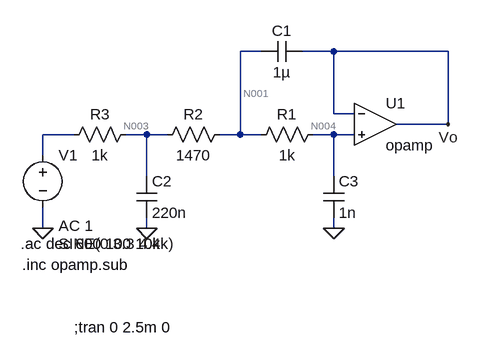
[diagram p0: schematic Chebyshev.asc]
Chebyshev.asc, the LTspice schematic file:
Version 4
SHEET 1 1096 680
WIRE 32 64 0 64
WIRE 144 64 96 64
WIRE 320 64 144 64
WIRE 144 160 144 64
WIRE 176 160 144 160
WIRE 320 176 320 64
WIRE 320 176 240 176
WIRE -256 192 -304 192
WIRE -144 192 -176 192
WIRE -112 192 -144 192
WIRE 0 192 0 64
WIRE 0 192 -32 192
WIRE 32 192 0 192
WIRE 144 192 112 192
WIRE 176 192 144 192
WIRE -304 224 -304 192
WIRE -144 256 -144 192
WIRE 144 256 144 192
WIRE -304 336 -304 304
WIRE -144 336 -144 320
WIRE 144 336 144 320
FLAG -144 336 0
FLAG 144 336 0
FLAG 320 176 Vo
FLAG -304 336 0
SYMBOL OpAmps\\opamp 208 112 R0
SYMATTR InstName U1
SYMBOL res 128 176 R90
WINDOW 0 0 56 VBottom 2
WINDOW 3 32 56 VTop 2
SYMATTR InstName R1
SYMATTR Value 1k
SYMBOL res -16 176 R90
WINDOW 0 0 56 VBottom 2
WINDOW 3 32 56 VTop 2
SYMATTR InstName R2
SYMATTR Value 1470
SYMBOL res -160 176 R90
WINDOW 0 0 56 VBottom 2
WINDOW 3 32 56 VTop 2
SYMATTR InstName R3
SYMATTR Value 1k
SYMBOL cap -160 256 R0
SYMATTR InstName C2
SYMATTR Value 220n
SYMBOL cap 128 256 R0
SYMATTR InstName C3
SYMATTR Value 1n
SYMBOL cap 96 48 R90
WINDOW 0 0 32 VBottom 2
WINDOW 3 32 32 VTop 2
SYMATTR InstName C1
SYMATTR Value 1µ
SYMBOL voltage -304 208 R0
WINDOW 3 24 152 Left 2
WINDOW 123 24 124 Left 2
WINDOW 39 0 0 Left 0
SYMATTR InstName V1
SYMATTR Value SINE(0 3.3 4.4k)
SYMATTR Value2 AC 1
TEXT -338 360 Left 2 !.ac dec 600 100 10k
TEXT -336 392 Left 2 !.inc opamp.sub
TEXT -256 488 Left 2 !;tran 0 2.5m 0

The netlist it stands for:
* Chebyshev.asc
XU1 Vo N004 Vo opamp Aol=100K GBW=10Meg  ; pins invin noninvin out
R1 N004 N001 1k
R2 N001 N003 1470
R3 N003 N002 1k
C2 N003 0 220n
C3 N004 0 1n
C1 Vo N001 1µ
V1 N002 0 SINE(0 3.3 4.4k) AC 1
.ac dec 600 100 10k
.inc opamp.sub
;tran 0 2.5m 0
.backanno
.end

* Results of the author's LTspice run, read from the files saved beside the schematic
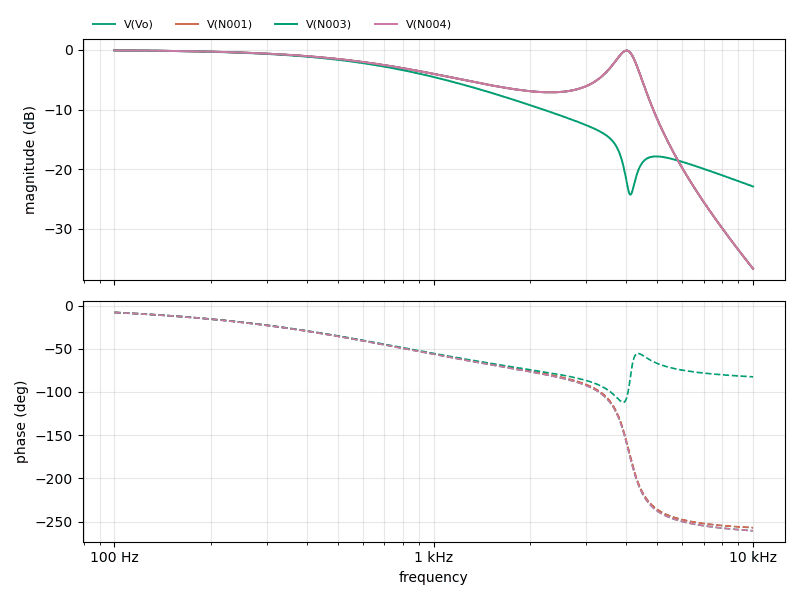
[diagram p1: AC Analysis of Chebyshev.asc, plotted from the saved traces]
* AC Analysis, 1 run:
*   V(Vo): -0.07 dB at 100 Hz, -36.70 dB at 10 kHz, peak -0.07 dB at 100 Hz, 3 dB below the peak at 805.5 Hz
*   V(N001): -0.07 dB at 100 Hz, -36.68 dB at 10 kHz, peak -0.07 dB at 100 Hz, 3 dB below the peak at 805.6 Hz
*   V(N003): -0.08 dB at 100 Hz, -22.89 dB at 10 kHz, peak -0.08 dB at 100 Hz, 3 dB below the peak at 749 Hz
*   V(N004): -0.07 dB at 100 Hz, -36.70 dB at 10 kHz, peak -0.07 dB at 100 Hz, 3 dB below the peak at 805.5 Hz